# Altium schematic sheet NB2_PBCON.schdoc: Peripheral Board Connector
size A4; Organization: Altium Limited.; Address1: Level 3, 12a Rodborough Rd; Address2: Frenchs Forest 2086; Address3: NSW; Address4: AUSTRALIA; SheetNumber: 1; SheetTotal: 100
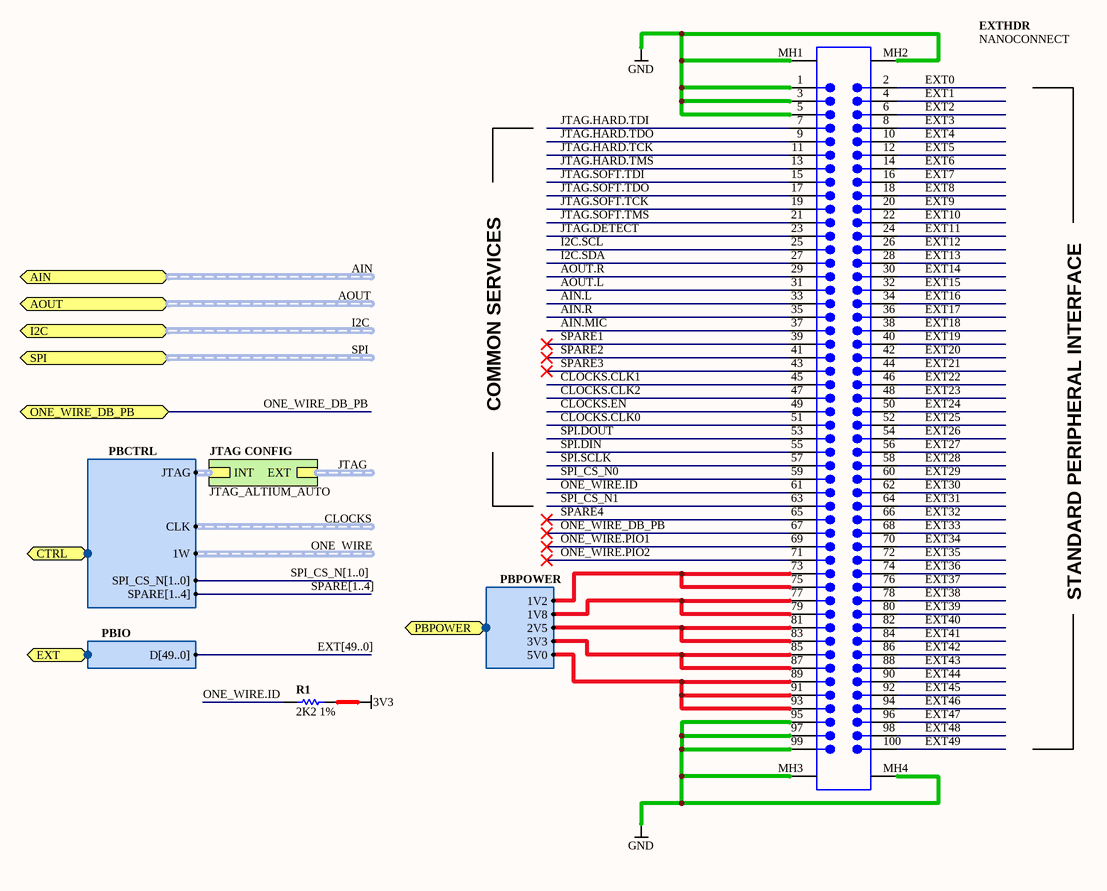
[diagram p0: NB2_PBCON.schdoc]

## Parts
EXTHDR  NANOCONNECT  [53751]
R1  2K2 1%  [RESC1005-STAR]

## Sub-sheets
JTAG CONFIG = JTAG_ALTIUM_AUTO: EXT (harness JTAG_CONFIG), INT (harness JTAG_CONFIG)

## Ports
AIN (harness AUDIO_IN), AOUT (harness AUDIO_OUT), CTRL (harness PBCTRL), EXT (harness PBIO), I2C (harness I2C), ONE_WIRE_DB_PB (bidir), PBPOWER (harness PBPOWER), SPI (harness EXTSPI)

## Harnesses
PBIO: D[49..0]
PBCTRL: JTAG, CLK, 1W, SPI_CS_N[1..0], SPARE[1..4]
PBPOWER: 1V2, 1V8, 2V5, 3V3, 5V0

## Nets
3V3: R1.2
GND: EXTHDR.1 EXTHDR.3 EXTHDR.5 EXTHDR.95 EXTHDR.97 EXTHDR.99 EXTHDR.MH1 EXTHDR.MH2 EXTHDR.MH3 EXTHDR.MH4
AIN.L: EXTHDR.33
AIN.MIC: EXTHDR.37
AIN.R: EXTHDR.35
AOUT.L: EXTHDR.31
AOUT.R: EXTHDR.29
CLOCKS.CLK0: EXTHDR.51
CLOCKS.CLK1: EXTHDR.45
CLOCKS.CLK2: EXTHDR.47
CLOCKS.EN: EXTHDR.49
EXT0: EXTHDR.2
EXT1: EXTHDR.4
EXT2: EXTHDR.6
EXT3: EXTHDR.8
EXT4: EXTHDR.10
EXT5: EXTHDR.12
EXT6: EXTHDR.14
EXT7: EXTHDR.16
EXT8: EXTHDR.18
EXT9: EXTHDR.20
EXT10: EXTHDR.22
EXT11: EXTHDR.24
EXT12: EXTHDR.26
EXT13: EXTHDR.28
EXT14: EXTHDR.30
EXT15: EXTHDR.32
EXT16: EXTHDR.34
EXT17: EXTHDR.36
EXT18: EXTHDR.38
EXT19: EXTHDR.40
EXT20: EXTHDR.42
EXT21: EXTHDR.44
EXT22: EXTHDR.46
EXT23: EXTHDR.48
EXT24: EXTHDR.50
EXT25: EXTHDR.52
EXT26: EXTHDR.54
EXT27: EXTHDR.56
EXT28: EXTHDR.58
EXT29: EXTHDR.60
EXT30: EXTHDR.62
EXT31: EXTHDR.64
EXT32: EXTHDR.66
EXT33: EXTHDR.68
EXT34: EXTHDR.70
EXT35: EXTHDR.72
EXT36: EXTHDR.74
EXT37: EXTHDR.76
EXT38: EXTHDR.78
EXT39: EXTHDR.80
EXT40: EXTHDR.82
EXT41: EXTHDR.84
EXT42: EXTHDR.86
EXT43: EXTHDR.88
EXT44: EXTHDR.90
EXT45: EXTHDR.92
EXT46: EXTHDR.94
EXT47: EXTHDR.96
EXT48: EXTHDR.98
EXT49: EXTHDR.100
I2C.SCL: EXTHDR.25
I2C.SDA: EXTHDR.27
JTAG.DETECT: EXTHDR.23
JTAG.HARD.TCK: EXTHDR.11
JTAG.HARD.TDI: EXTHDR.7
JTAG.HARD.TDO: EXTHDR.9
JTAG.HARD.TMS: EXTHDR.13
JTAG.SOFT.TCK: EXTHDR.19
JTAG.SOFT.TDI: EXTHDR.15
JTAG.SOFT.TDO: EXTHDR.17
JTAG.SOFT.TMS: EXTHDR.21
ONE_WIRE.ID: EXTHDR.61 R1.1
ONE_WIRE.PIO1: EXTHDR.69
ONE_WIRE.PIO2: EXTHDR.71
ONE_WIRE_DB_PB: EXTHDR.67 ; port ONE_WIRE_DB_PB
SPARE1: EXTHDR.39
SPARE2: EXTHDR.41
SPARE3: EXTHDR.43
SPARE4: EXTHDR.65
SPI.DIN: EXTHDR.55
SPI.DOUT: EXTHDR.53
SPI.SCLK: EXTHDR.57
SPI_CS_N0: EXTHDR.59
SPI_CS_N1: EXTHDR.63
NetEXTHDR_73: EXTHDR.73 EXTHDR.75 ; port PBPOWER.1V2
NetEXTHDR_77: EXTHDR.77 EXTHDR.79 ; port PBPOWER.1V8
NetEXTHDR_81: EXTHDR.81 EXTHDR.83 ; port PBPOWER.2V5
NetEXTHDR_85: EXTHDR.85 EXTHDR.87 ; port PBPOWER.3V3
NetEXTHDR_89: EXTHDR.89 EXTHDR.91 EXTHDR.93 ; port PBPOWER.5V0

## Buses and harness runs
bus EXT[49..0]
bus SPARE[1..4]
bus SPI_CS_N[1..0]
harness AIN = port AIN
harness AOUT = port AOUT
harness I2C = port I2C
harness JTAG = sheet JTAG CONFIG/EXT
harness SPI = port SPI

## Notes on the sheet
- COMMON SERVICES
- STANDARD PERIPHERAL INTERFACE
- Sheet Title
- Project Title
- Size:
- Date:
- A4
- Assy:
- Time:
- Revision:
- Sheet
- of
- File:

## Library data of the parts
EXTHDR = D-300-0026: Connector, Molex Docking Station 100 Pin Female 53751; Connector type: MOLEX - 53751-1009; Category: Connector; Status: Production
R1 = D-100-0107: Resistor, 2K2 1% 0402 (1005); Power Rating: 63 mW; Resistance: 2.2 K; Category: Resistor; Mounting Technology: Surface Mount; Status: Production; Tolerance: 1 %